# Altium schematic sheet Ethernet.SchDoc
size B
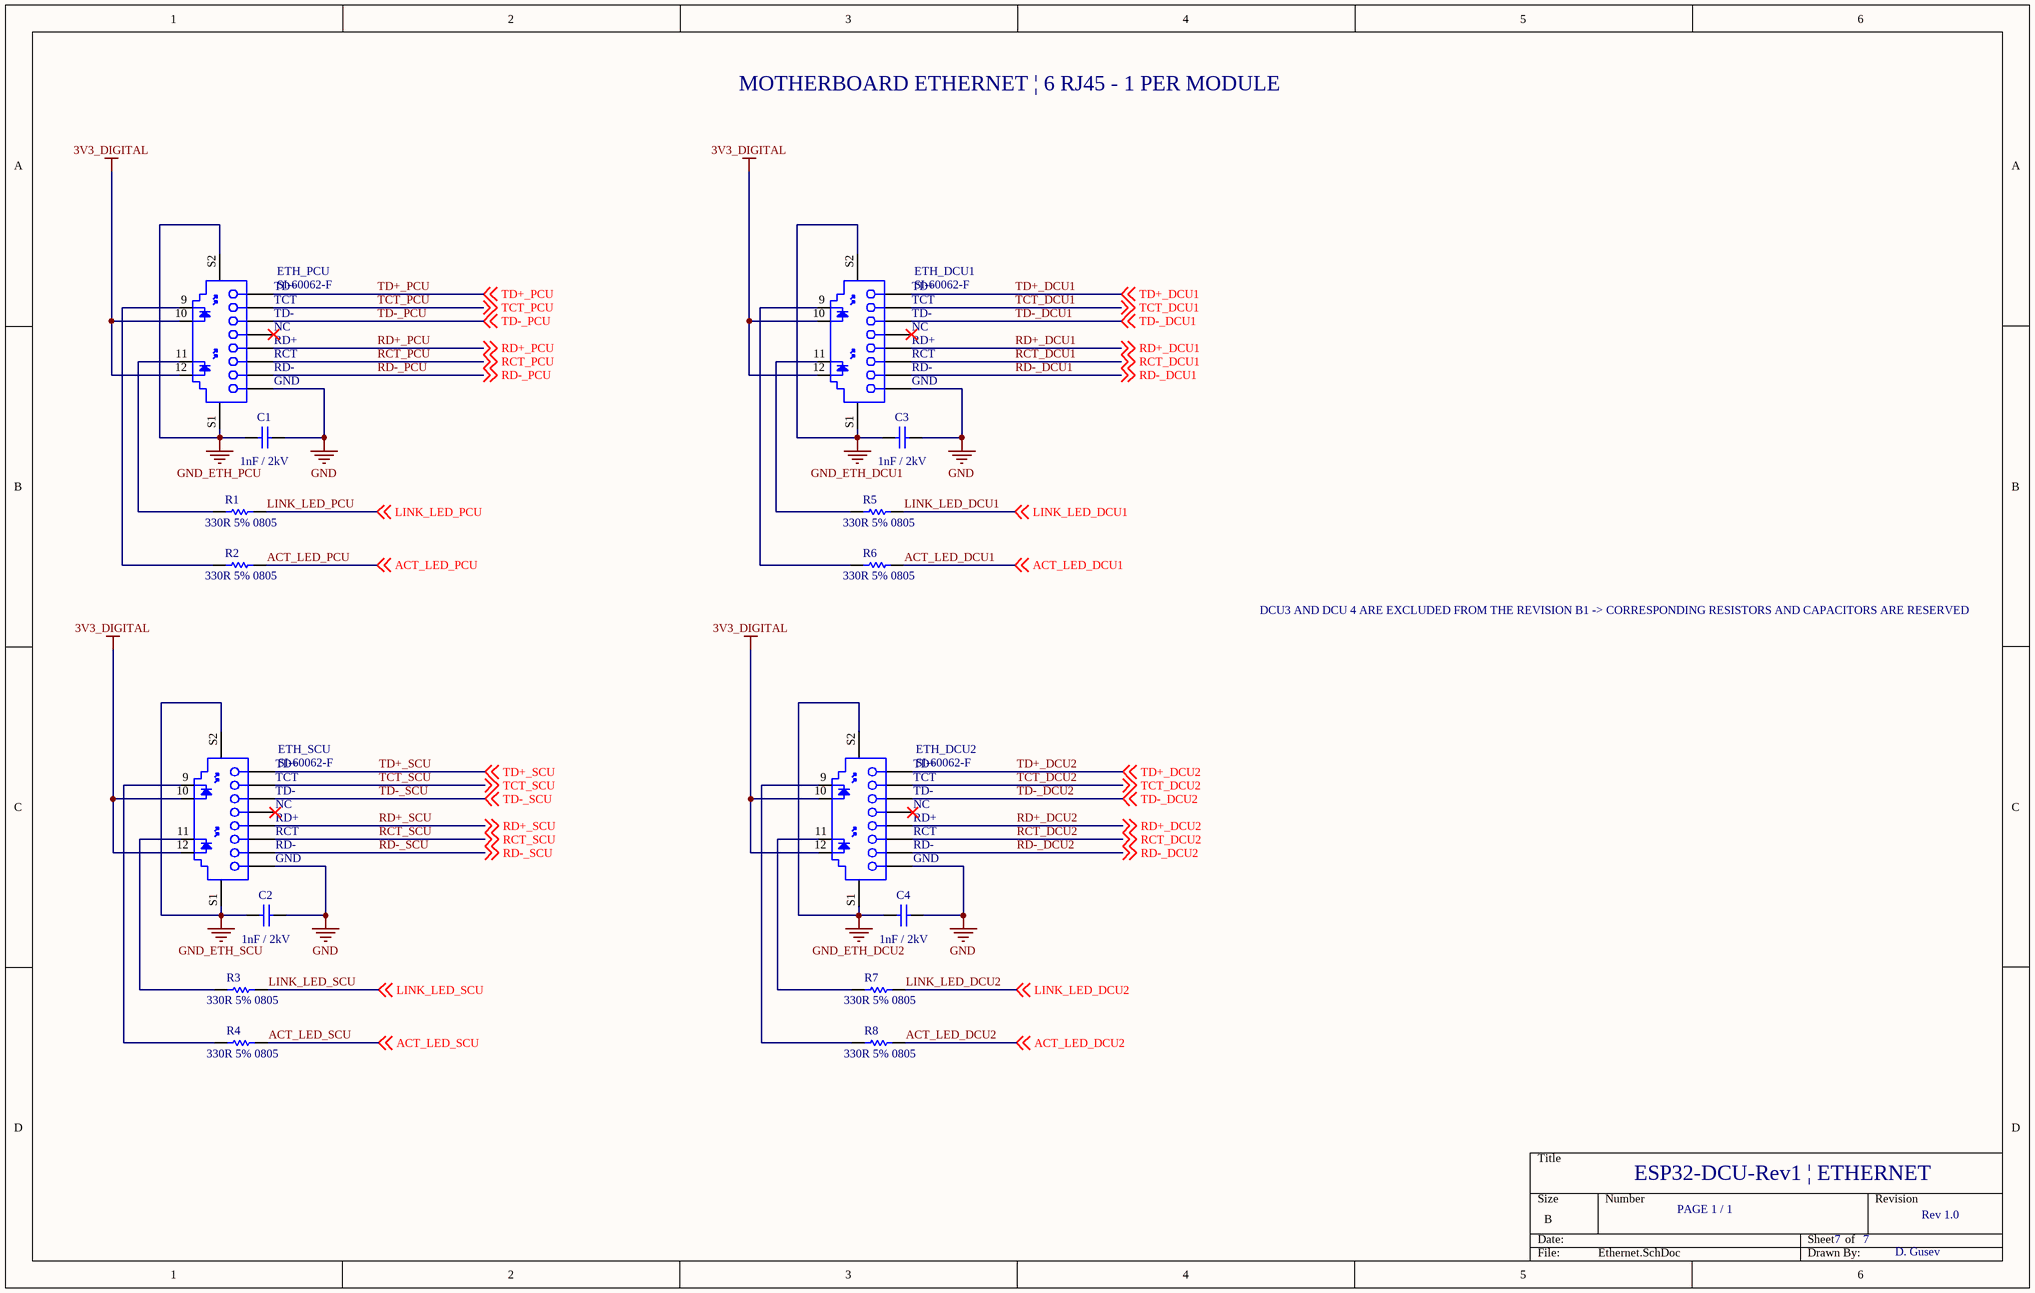
[diagram p0: Ethernet.SchDoc]

## Parts
C1  1nF / 2kV  [CAPC4532X155X60LL30T35]
C2  1nF / 2kV  [CAPC4532X155X60LL30T35]
C3  1nF / 2kV  [CAPC4532X155X60LL30T35]
C4  1nF / 2kV  [CAPC4532X155X60LL30T35]
ETH_DCU1  SI-60062-F  [BELF-SI-60062-F_V]
ETH_DCU2  SI-60062-F  [BELF-SI-60062-F_V]
ETH_PCU  SI-60062-F  [BELF-SI-60062-F_V]
ETH_SCU  SI-60062-F  [BELF-SI-60062-F_V]
R1  330R 5% 0805  [RESC2013X60X35LL10T20]
R2  330R 5% 0805  [RESC2013X60X35LL10T20]
R3  330R 5% 0805  [RESC2013X60X35LL10T20]
R4  330R 5% 0805  [RESC2013X60X35LL10T20]
R5  330R 5% 0805  [RESC2013X60X35LL10T20]
R6  330R 5% 0805  [RESC2013X60X35LL10T20]
R7  330R 5% 0805  [RESC2013X60X35LL10T20]
R8  330R 5% 0805  [RESC2013X60X35LL10T20]

## Nets
3V3_DIGITAL: ETH_DCU1.10 ETH_DCU1.12 ETH_DCU2.10 ETH_DCU2.12 ETH_PCU.10 ETH_PCU.12 ETH_SCU.10 ETH_SCU.12
GND: C1.2 C2.2 C3.2 C4.2 ETH_DCU1.8(GND) ETH_DCU2.8(GND) ETH_PCU.8(GND) ETH_SCU.8(GND)
GND_ETH_DCU1: C3.1 ETH_DCU1.S1 ETH_DCU1.S2
GND_ETH_DCU2: C4.1 ETH_DCU2.S1 ETH_DCU2.S2
GND_ETH_PCU: C1.1 ETH_PCU.S1 ETH_PCU.S2
GND_ETH_SCU: C2.1 ETH_SCU.S1 ETH_SCU.S2
ACT_LED_DCU1: R6.2 ; off-sheet ACT_LED_DCU1
ACT_LED_DCU2: R8.2 ; off-sheet ACT_LED_DCU2
ACT_LED_PCU: R2.2 ; off-sheet ACT_LED_PCU
ACT_LED_SCU: R4.2 ; off-sheet ACT_LED_SCU
LINK_LED_DCU1: R5.2 ; off-sheet LINK_LED_DCU1
LINK_LED_DCU2: R7.2 ; off-sheet LINK_LED_DCU2
LINK_LED_PCU: R1.2 ; off-sheet LINK_LED_PCU
LINK_LED_SCU: R3.2 ; off-sheet LINK_LED_SCU
RCT_DCU1: ETH_DCU1.6(RCT) ; off-sheet RCT_DCU1
RCT_DCU2: ETH_DCU2.6(RCT) ; off-sheet RCT_DCU2
RCT_PCU: ETH_PCU.6(RCT) ; off-sheet RCT_PCU
RCT_SCU: ETH_SCU.6(RCT) ; off-sheet RCT_SCU
RD+_DCU1: ETH_DCU1.5(RD+) ; off-sheet RD+_DCU1
RD+_DCU2: ETH_DCU2.5(RD+) ; off-sheet RD+_DCU2
RD+_PCU: ETH_PCU.5(RD+) ; off-sheet RD+_PCU
RD+_SCU: ETH_SCU.5(RD+) ; off-sheet RD+_SCU
RD-_DCU1: ETH_DCU1.7(RD-) ; off-sheet RD-_DCU1
RD-_DCU2: ETH_DCU2.7(RD-) ; off-sheet RD-_DCU2
RD-_PCU: ETH_PCU.7(RD-) ; off-sheet RD-_PCU
RD-_SCU: ETH_SCU.7(RD-) ; off-sheet RD-_SCU
TCT_DCU1: ETH_DCU1.2(TCT) ; off-sheet TCT_DCU1
TCT_DCU2: ETH_DCU2.2(TCT) ; off-sheet TCT_DCU2
TCT_PCU: ETH_PCU.2(TCT) ; off-sheet TCT_PCU
TCT_SCU: ETH_SCU.2(TCT) ; off-sheet TCT_SCU
TD+_DCU1: ETH_DCU1.1(TD+) ; off-sheet TD+_DCU1
TD+_DCU2: ETH_DCU2.1(TD+) ; off-sheet TD+_DCU2
TD+_PCU: ETH_PCU.1(TD+) ; off-sheet TD+_PCU
TD+_SCU: ETH_SCU.1(TD+) ; off-sheet TD+_SCU
TD-_DCU1: ETH_DCU1.3(TD-) ; off-sheet TD-_DCU1
TD-_DCU2: ETH_DCU2.3(TD-) ; off-sheet TD-_DCU2
TD-_PCU: ETH_PCU.3(TD-) ; off-sheet TD-_PCU
TD-_SCU: ETH_SCU.3(TD-) ; off-sheet TD-_SCU
NetETH_DCU1_9: ETH_DCU1.9 R6.1
NetETH_DCU1_11: ETH_DCU1.11 R5.1
NetETH_DCU2_9: ETH_DCU2.9 R8.1
NetETH_DCU2_11: ETH_DCU2.11 R7.1
NetETH_PCU_9: ETH_PCU.9 R2.1
NetETH_PCU_11: ETH_PCU.11 R1.1
NetETH_SCU_9: ETH_SCU.9 R4.1
NetETH_SCU_11: ETH_SCU.11 R3.1

Not connected (* = marked no-connect by the designer): ETH_DCU1 4(NC)*; ETH_DCU2 4(NC)*; ETH_PCU 4(NC)*; ETH_SCU 4(NC)*

## Notes on the sheet
- MOTHERBOARD ETHERNET | 6 RJ45 - 1 PER MODULE
- DCU3 AND DCU 4 ARE EXCLUDED FROM THE REVISION B1 -> CORRESPONDING RESISTORS AND CAPACITORS ARE RESERVED
- ESP32-DCU-Rev1 | ETHERNET
- PAGE 1 / 1
- 7
- Rev 1.0
- D. Gusev

## Library data of the parts
C1-C4 = CMP-2000-06032-1: Chip Capacitor, 1000 pF, +/- 10%, 2000 V, -55 to 125 degC, 1812 (4532 Metric), RoHS, Tape and Reel; Manufacturer: Kemet; Kits: 399-5086-ND-KITCERHI-VOLTAGECAPS; Catalog Drawings: ACTU_1812; Capacitance: 1000pF; Product Training Modules: CapacitorBasics-TypicalUsesforCapacitors; Online Catalog: X7RDielectricHighVoltage; Other Names: 399-3447-1; Temperature Coefficient: X7R; Voltage - Rated: 2000V(2kV); Family: CeramicCapacitors; Height - Seated (Max): -; Standard Package: 1; Size / Dimension: 0.177"Lx0.126"W(4.50mmx3.20mm); Datasheet URL: http://capacitoredge.kemet.com/capedge2/DataSheet/Datasheet-C1812C102KGRACTU.pdf?pn=C1812C102KGRACTU; Datasheet Version: 09/2016; Thickness (Max): 0.061"(1.55mm); Applications: SMPSFiltering; Package Description: 2-Pin Surface Mount Device, Body 4.5 x 3.2 mm; Package Reference: 1812; Mounting Technology: SurfaceMount; Packaging: CutTape(CT); Manufacturer URL: http://www.kemet.com/; Operating Temperature: -55°C~125°C; Mounting Type: SurfaceMount,MLCC; Features: HighVoltage; Package / Case: 1812(4532Metric); Lead Spacing: -; Tolerance: ±10%; Lead Style: -; Series: C; Category: Capacitors; Ratings: -
ETH_DCU1 ETH_DCU2 ETH_PCU ETH_SCU = CMP-2000-07059-1: 1 Port RJ45 Magjack Connector with Yellow and Green LED, 10/100 Base-T, 12-Pin THD, RoHS, Tray; Manufacturer: Bel Fuse; Number of Ways: 8P4C; Gender: Female; Shield Type: STP; Connector Type: RJ45; Contact Plating: Gold; Mounting Type: ThroughHole; Datasheet Version: Rev. B0, 09/2008; Package Reference: SI-60062-F; Manufacturer URL: http://belfuse.com/; Package Description: 12-Pin Through Hole Device, Body 21.59 x 16.13 mm; Series: MagJack; Contact Material: CopperAlloy; Datasheet URL: http://belfuse.com/pdfs/SI-60062-F.pdf; Width: 17.98mm; Length: 15.21mm; Mounting Technology: ThroughHole; Depth: 21.59mm; Orientation: Straight
R1-R8 = CMP-2000-06960-1: Chip Resistor, 330 Ohm, +/- 1%, 125 mW, -55 to 155 degC, 0805 (2012 Metric), RoHS, Tape and Reel; Manufacturer: Yageo; Voltage Rating: 150V; Temperature Coefficient: 100PPM/C; Power Rating: 125mW(1/8W); Resistance: 330Ohms; Datasheet Version: Rev. 7, 05/2017; Termination Style: SMD/SMT; Case Code - mm: 2012; Package Description: 2-Pin Surface Mounted Device, Body 2 x 1.25 mm; Operating Temperature Range: -55Cto+155C; Case Code - in: 0805; Packaging: Reel; Tolerance: 1%; Package Reference: 0805; Mounting Technology: SurfaceMount; Product: ThickFilmResistorsGeneralPurpose; Series: RC; Manufacturer URL: http://www.yageo.com/; Datasheet URL: http://www.yageo.com/documents/recent/PYu-RC_Group_51_RoHS_L_7.pdf